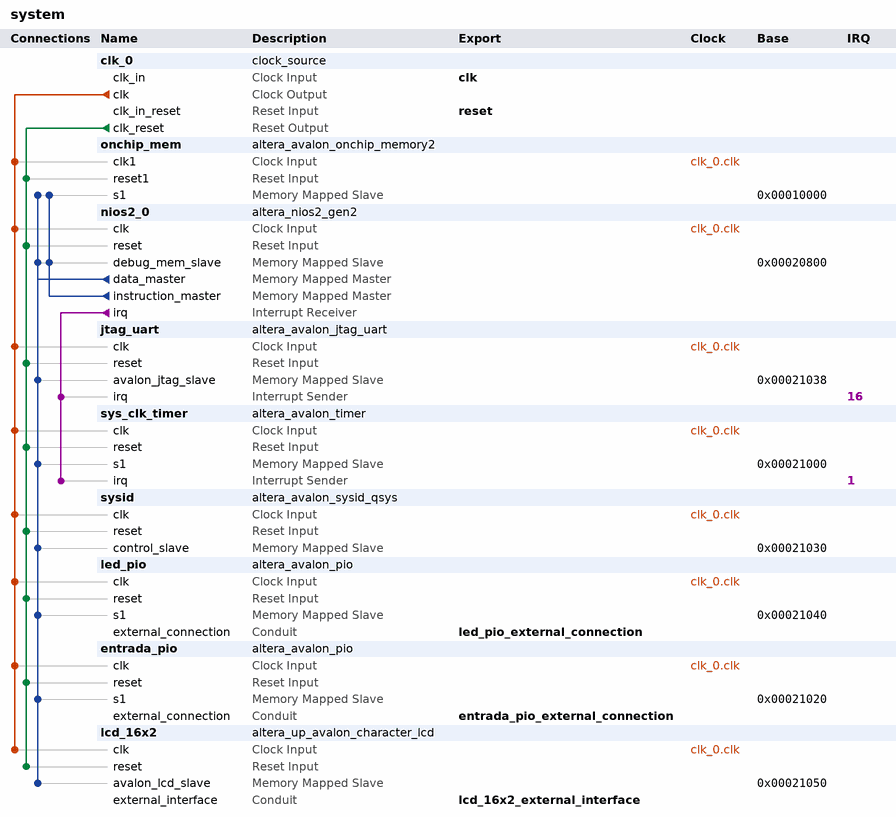
[diagram p0: system contents]
# Platform Designer (Qsys) system system, Cyclone IV E EP4CE115F29C7
# Parameters at their usual value, and those the tool derives, are not listed.
package require -exact qsys 20.1
create_system system
set_project_property DEVICE_FAMILY {Cyclone IV E}
set_project_property DEVICE EP4CE115F29C7

add_instance clk_0 clock_source 20.1
set_instance_parameter_value clk_0 clockFrequency 50000000

add_instance onchip_mem altera_avalon_onchip_memory2 20.1
set_instance_parameter_value onchip_mem dataWidth 32
set_instance_parameter_value onchip_mem dualPort false
set_instance_parameter_value onchip_mem initMemContent true
set_instance_parameter_value onchip_mem initializationFileName onchip_mem.hex
set_instance_parameter_value onchip_mem memorySize 40960

add_instance nios2_0 altera_nios2_gen2 20.1
set_instance_parameter_value nios2_0 dcache_size 2048
set_instance_parameter_value nios2_0 exceptionSlave onchip_mem.s1
set_instance_parameter_value nios2_0 icache_size 2048
set_instance_parameter_value nios2_0 impl Fast
set_instance_parameter_value nios2_0 resetSlave onchip_mem.s1

add_instance jtag_uart altera_avalon_jtag_uart 20.1
set_instance_parameter_value jtag_uart simInteractiveOptions NO_INTERACTIVE_WINDOWS

add_instance sys_clk_timer altera_avalon_timer 20.1
set_instance_parameter_value sys_clk_timer period 1
set_instance_parameter_value sys_clk_timer periodUnits MSEC

add_instance sysid altera_avalon_sysid_qsys 20.1
set_instance_parameter_value sysid id 1

add_instance led_pio altera_avalon_pio 20.1
set_instance_parameter_value led_pio direction Output
set_instance_parameter_value led_pio width 19

add_instance entrada_pio altera_avalon_pio 20.1
set_instance_parameter_value entrada_pio direction Input
set_instance_parameter_value entrada_pio width 19

add_instance lcd_16x2 altera_up_avalon_character_lcd 18.0
set_instance_parameter_value lcd_16x2 cursor Blinking

# connections
add_connection clk_0.clk entrada_pio.clk clock
add_connection clk_0.clk jtag_uart.clk clock
add_connection clk_0.clk lcd_16x2.clk clock
add_connection clk_0.clk led_pio.clk clock
add_connection clk_0.clk nios2_0.clk clock
add_connection clk_0.clk onchip_mem.clk1 clock
add_connection clk_0.clk sys_clk_timer.clk clock
add_connection clk_0.clk sysid.clk clock
add_connection clk_0.clk_reset entrada_pio.reset reset
add_connection clk_0.clk_reset jtag_uart.reset reset
add_connection clk_0.clk_reset lcd_16x2.reset reset
add_connection clk_0.clk_reset led_pio.reset reset
add_connection clk_0.clk_reset nios2_0.reset reset
add_connection clk_0.clk_reset onchip_mem.reset1 reset
add_connection clk_0.clk_reset sys_clk_timer.reset reset
add_connection clk_0.clk_reset sysid.reset reset
add_connection nios2_0.data_master entrada_pio.s1 avalon
set_connection_parameter_value nios2_0.data_master/entrada_pio.s1 baseAddress 0x00021020
add_connection nios2_0.data_master jtag_uart.avalon_jtag_slave avalon
set_connection_parameter_value nios2_0.data_master/jtag_uart.avalon_jtag_slave baseAddress 0x00021038
add_connection nios2_0.data_master lcd_16x2.avalon_lcd_slave avalon
set_connection_parameter_value nios2_0.data_master/lcd_16x2.avalon_lcd_slave baseAddress 0x00021050
add_connection nios2_0.data_master led_pio.s1 avalon
set_connection_parameter_value nios2_0.data_master/led_pio.s1 baseAddress 0x00021040
add_connection nios2_0.data_master nios2_0.debug_mem_slave avalon
set_connection_parameter_value nios2_0.data_master/nios2_0.debug_mem_slave baseAddress 0x00020800
add_connection nios2_0.data_master onchip_mem.s1 avalon
set_connection_parameter_value nios2_0.data_master/onchip_mem.s1 baseAddress 0x00010000
add_connection nios2_0.data_master sys_clk_timer.s1 avalon
set_connection_parameter_value nios2_0.data_master/sys_clk_timer.s1 baseAddress 0x00021000
add_connection nios2_0.data_master sysid.control_slave avalon
set_connection_parameter_value nios2_0.data_master/sysid.control_slave baseAddress 0x00021030
add_connection nios2_0.instruction_master nios2_0.debug_mem_slave avalon
set_connection_parameter_value nios2_0.instruction_master/nios2_0.debug_mem_slave baseAddress 0x00020800
add_connection nios2_0.instruction_master onchip_mem.s1 avalon
set_connection_parameter_value nios2_0.instruction_master/onchip_mem.s1 baseAddress 0x00010000
add_connection nios2_0.irq jtag_uart.irq interrupt
set_connection_parameter_value nios2_0.irq/jtag_uart.irq irqNumber 16
add_connection nios2_0.irq sys_clk_timer.irq interrupt
set_connection_parameter_value nios2_0.irq/sys_clk_timer.irq irqNumber 1

# exported interfaces
add_interface clk clock sink
set_interface_property clk EXPORT_OF clk_0.clk_in
add_interface entrada_pio_external_connection conduit end
set_interface_property entrada_pio_external_connection EXPORT_OF entrada_pio.external_connection
add_interface lcd_16x2_external_interface conduit end
set_interface_property lcd_16x2_external_interface EXPORT_OF lcd_16x2.external_interface
add_interface led_pio_external_connection conduit end
set_interface_property led_pio_external_connection EXPORT_OF led_pio.external_connection
add_interface reset reset sink
set_interface_property reset EXPORT_OF clk_0.clk_in_reset

set_interconnect_requirement {$system} qsys_mm.clockCrossingAdapter HANDSHAKE
set_interconnect_requirement {$system} qsys_mm.enableEccProtection FALSE
set_interconnect_requirement {$system} qsys_mm.insertDefaultSlave FALSE
set_interconnect_requirement {$system} qsys_mm.maxAdditionalLatency 1

save_system system.qsys
